# EAGLE design mcp3008_rpi_SOIP (EAGLE 7.2.0)
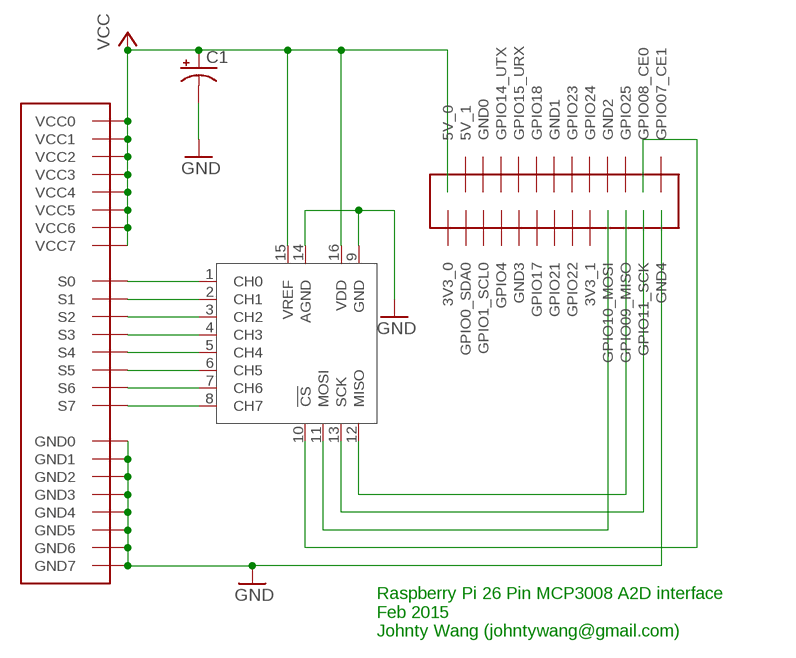
[diagram p0: schematic, sheet 1]

## Parts
C1  CPOL-USE2.5-6  [E2,5-6]
U$1  3BY83X8_SAMTEC  [3X8_PKG]
U$2  RPI_26  [RPI26]
U$3  MCP3008SL  [SO16]

## Nets
GND: C1.- U$1.GND0 U$1.GND1 U$1.GND2 U$1.GND3 U$1.GND4 U$1.GND5 U$1.GND6 U$1.GND7 U$2.GND4 U$3.9(GND) U$3.14(AGND)
N$1: U$1.S0 U$3.1(CH0)
N$2: U$1.S1 U$3.2(CH1)
N$3: U$1.S2 U$3.3(CH2)
N$4: U$1.S3 U$3.4(CH3)
N$5: U$1.S4 U$3.5(CH4)
N$6: U$1.S5 U$3.6(CH5)
N$7: U$1.S6 U$3.7(CH6)
N$8: U$1.S7 U$3.8(CH7)
N$9: U$2.GPIO09(GPIO09_MISO) U$3.12(MISO)
N$10: U$2.GPIO11(GPIO11_SCK) U$3.13(SCK)
N$11: U$2.GPIO10(GPIO10_MOSI) U$3.11(MOSI)
N$12: U$2.GPIO08(GPIO08_CE0) U$3.10(!CS)
VCC: C1.+ U$1.VCC0 U$1.VCC1 U$1.VCC2 U$1.VCC3 U$1.VCC4 U$1.VCC5 U$1.VCC6 U$1.VCC7 U$2.5V0(5V_0) U$3.15(VREF) U$3.16(VDD)
Unconnected: U$2.3V3_0 U$2.3V3_1 U$2.5V1(5V_1) U$2.GND0 U$2.GND1 U$2.GND2 U$2.GND3 U$2.GPIO0(GPIO0_SDA0) U$2.GPIO01(GPIO1_SCL0) U$2.GPIO04(GPIO4) U$2.GPIO07(GPIO07_CE1) U$2.GPIO14(GPIO14_UTX) U$2.GPIO15(GPIO15_URX) U$2.GPIO17 U$2.GPIO18 U$2.GPIO21 U$2.GPIO22 U$2.GPIO23 U$2.GPIO24 U$2.GPIO25

## Notes on the sheet
- Raspberry Pi 26 Pin MCP3008 A2D interface
  Feb 2015
  Johnty Wang (johntywang@gmail.com)

## Library data of the parts
C1 = rcl:CPOL-US: POLARIZED CAPACITOR, American symbol
U$1 = jt_lib:3BY8: a 3 by 8 header
U$2 = jt_lib:RPI_26: RPi GPIO header (26 pin)
U$3 = MCP3008:MCP3008

## Net classes
0 default: width 0.254 mm

## Board
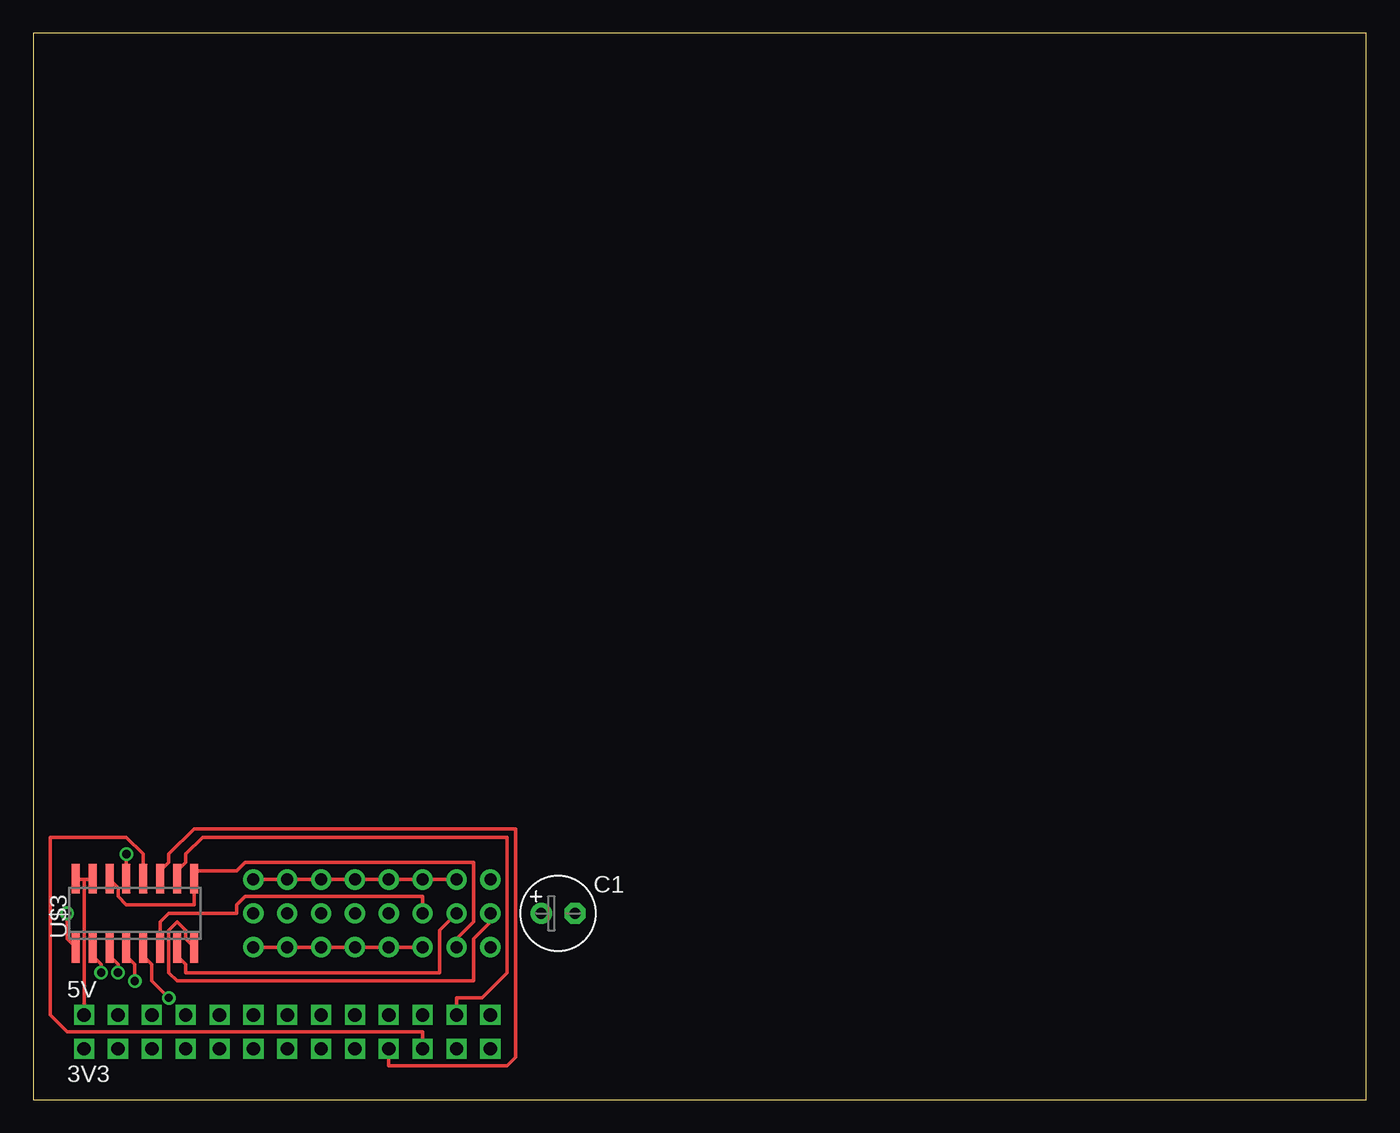
[diagram p1: board, top side]
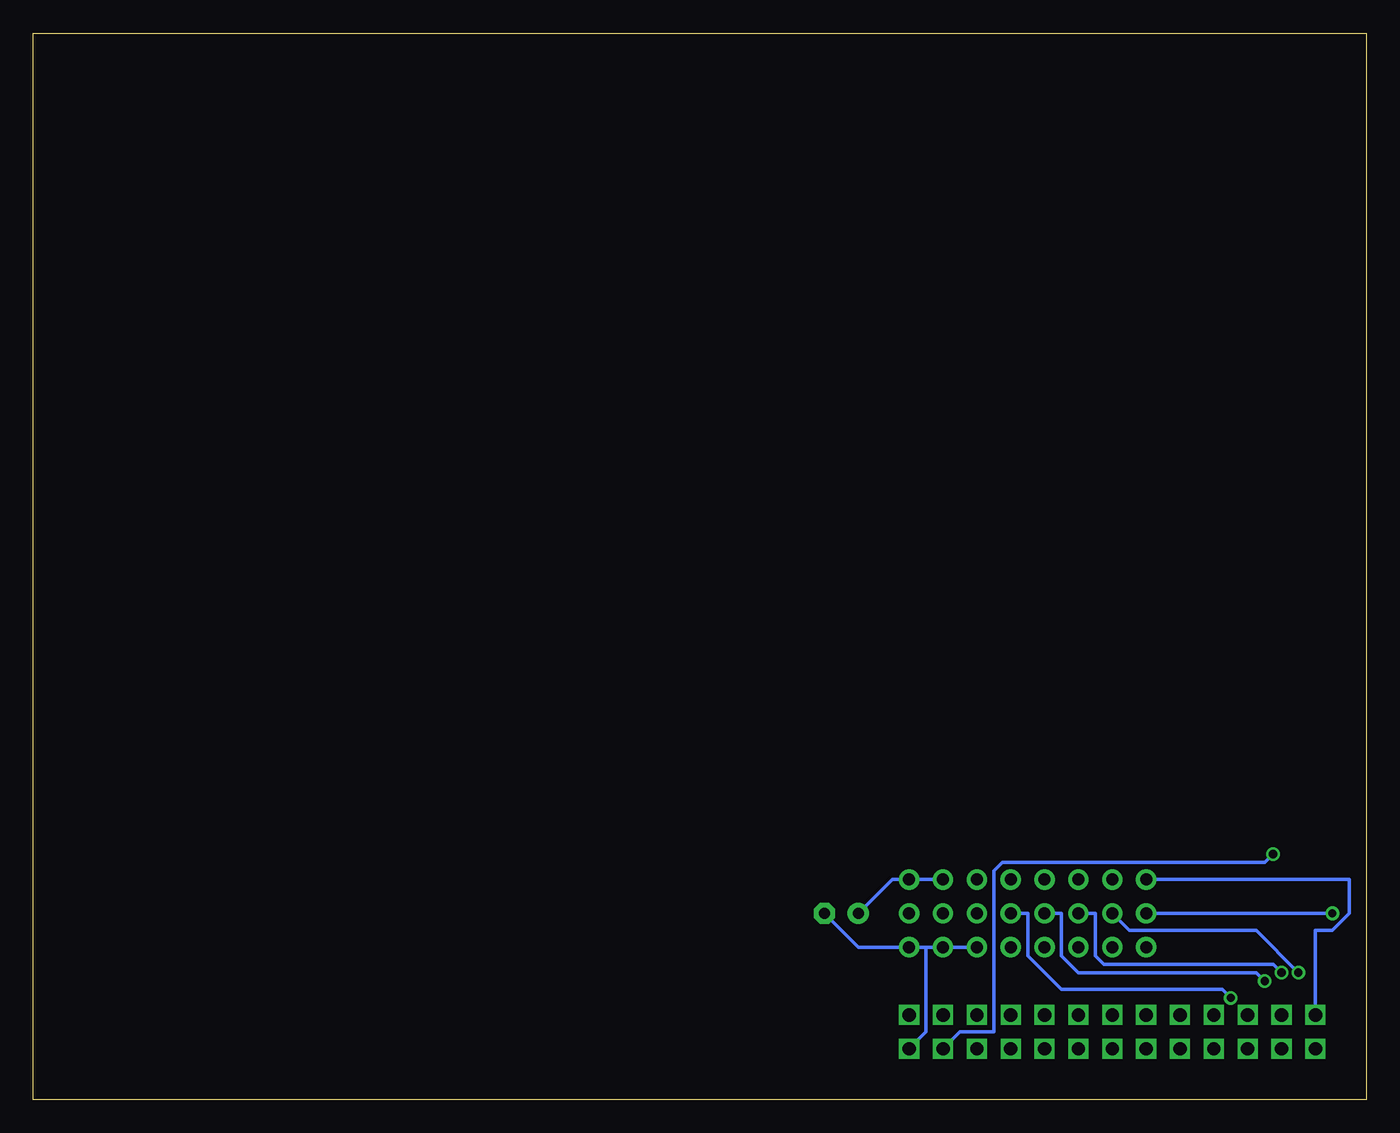
[diagram p2: board, bottom side, seen from below]

Size 100 x 80 mm. Coordinates in mm from the lower left corner, seen from the top.
Outline: 0,0 100,0 100,80 0,80 0,0
Copper layers (1*16): Top 0.035mm / dielectric 1.5mm / Bottom 0.035mm
Design rules "default": minimum track width 10mil, minimum drill 24mil, track to track 8mil, track to pad 8mil, pad to pad 8mil, via to via 8mil, smd to smd 8mil, copper to edge 40mil, drill to drill 8mil, minimum pad ring 10mil, minimum via ring 8mil, stop-mask expansion 4mil, vias tented up to drill 0mil, thermal gap 10mil

### Footprints (pad centres in the part's own frame; a part is rotated, then mirrored left to right if it is on the bottom)
E2,5-6 = drill 0.813 pad 1.6: + -1.27,0 | drill 0.813 pad 1.6 octagon: - 1.27,0
3X8_PKG = drill 0.9 pad 1.524: GND0 -5.08,-3.81; GND1 -2.54,-3.81; GND2 0,-3.81; GND3 2.54,-3.81; GND4 5.08,-3.81; GND5 7.62,-3.81; GND6 10.16,-3.81; GND7 12.7,-3.81; S0 -5.08,-1.27; S1 -2.54,-1.27; S2 0,-1.27; S3 2.54,-1.27; S4 5.08,-1.27; S5 7.62,-1.27; S6 10.16,-1.27; S7 12.7,-1.27; VCC0 -5.08,1.27; VCC1 -2.54,1.27; VCC2 0,1.27; VCC3 2.54,1.27; VCC4 5.08,1.27; VCC5 7.62,1.27; VCC6 10.16,1.27; VCC7 12.7,1.27
RPI26 = drill 1 square: 3V3_0 -13.97,-1.27; 3V3_1 6.35,-1.27; 5V0 -13.97,1.27; 5V1 -11.43,1.27; GND0 -8.89,1.27; GND1 1.27,1.27; GND2 8.89,1.27; GND3 -3.81,-1.27; GND4 16.51,-1.27; GPIO0 -11.43,-1.27; GPIO01 -8.89,-1.27; GPIO04 -6.35,-1.27; GPIO07 16.51,1.27; GPIO08 13.97,1.27; GPIO09 11.43,-1.27; GPIO10 8.89,-1.27; GPIO11 13.97,-1.27; GPIO14 -6.35,1.27; GPIO15 -3.81,1.27; GPIO17 -1.27,-1.27; GPIO18 -1.27,1.27; GPIO21 1.27,-1.27; GPIO22 3.81,-1.27; GPIO23 3.81,1.27; GPIO24 6.35,1.27; GPIO25 11.43,1.27
SO16 = smd 0.6 x 2.2: 1 -4.445,-2.6; 2 -3.175,-2.6; 3 -1.905,-2.6; 4 -0.635,-2.6; 5 0.635,-2.6; 6 1.905,-2.6; 7 3.175,-2.6; 8 4.445,-2.6; 9 4.445,2.6; 10 3.175,2.6; 11 1.905,2.6; 12 0.635,2.6; 13 -0.635,2.6; 14 -1.905,2.6; 15 -3.175,2.6; 16 -4.445,2.6

### Placement (x,y rotation side)
C1  39.37,13.97 0 top
U$1  21.59,15.24 0 top
U$2  17.78,5.08 0 top
U$3  7.62,13.97 0 top

### Tracks (layer width: path | path; a pad name or v marks a point on that pad's centre or on a via)
GND
  Top 0.254: U$1.GND0 U$1.GND1 U$1.GND2 U$1.GND3 U$1.GND4 U$1.GND5 | U$3.14 5.71,16.51 6.35,15.88 6.35,15.24 6.99,14.61 12.06,14.61 U$3.9 12.06,17.14 15.24,17.14 15.88,17.78 33.02,17.78 33.02,13.34 31.75,12.06 U$1.GND6
  Bottom 0.254: U$2.GND4 33.02,5.08 33.02,11.43 | 33.02,11.43 U$1.GND6 U$1.GND5 | 33.02,11.43 U$1.GND7 38.1,11.43 C1.-
N$1  (via drill 0.61)
  Top 0.254: v2.54,13.97 2.54,12.06 3.17,11.43 U$3.1
  Bottom 0.254: U$1.S0 v2.54,13.97
N$2  (via drill 0.61)
  Top 0.254: v5.08,9.53 5.08,10.16 4.45,10.79 U$3.2
  Bottom 0.254: v5.08,9.53 8.26,12.7 17.78,12.7 U$1.S1
N$3  (via drill 0.61)
  Top 0.254: v6.35,9.53 6.35,10.16 5.71,10.79 U$3.3
  Bottom 0.254: v6.35,9.53 6.99,10.16 19.68,10.16 20.32,10.79 20.32,13.97 U$1.S2
N$4  (via drill 0.61)
  Top 0.254: v7.62,8.89 7.62,10.16 6.99,10.79 U$3.4
  Bottom 0.254: v7.62,8.89 8.26,9.53 21.59,9.53 22.86,10.79 22.86,13.97 U$1.S3
N$5  (via drill 0.61)
  Top 0.254: v10.16,7.62 8.89,8.89 8.89,10.16 8.26,10.79 U$3.5
  Bottom 0.254: v10.16,7.62 10.79,8.26 22.86,8.26 25.4,10.79 25.4,13.97 U$1.S4
N$6
  Top 0.254: U$3.6 9.53,13.34 10.16,13.97 15.24,13.97 15.24,14.61 15.88,15.24 29.21,15.24 U$1.S5
N$7
  Top 0.254: U$1.S6 30.48,12.7 30.48,9.53 11.43,9.53 11.43,10.16 10.79,10.79 U$3.7
N$8
  Top 0.254: U$1.S7 34.29,13.34 33.02,12.06 33.02,8.89 10.79,8.89 10.16,9.53 10.16,12.7 10.79,13.34 11.43,12.7 11.43,12.06 12.06,11.43 U$3.8
N$9
  Top 0.254: U$3.12 8.26,18.41 6.99,19.68 1.27,19.68 1.27,6.35 2.54,5.08 29.21,5.08 U$2.GPIO09
N$10  (via drill 0.61)
  Top 0.254: v6.99,18.41 U$3.13
  Bottom 0.254: v6.99,18.41 7.62,17.78 27.3,17.78 27.94,17.14 27.94,5.08 30.48,5.08 U$2.GPIO11
N$11
  Top 0.254: U$2.GPIO10 26.67,2.54 35.56,2.54 36.2,3.17 36.2,20.32 12.06,20.32 10.16,18.41 10.16,17.78 9.53,17.14 U$3.11
N$12
  Top 0.254: U$2.GPIO08 31.75,7.62 33.66,7.62 35.56,9.53 35.56,19.68 12.7,19.68 11.43,18.41 11.43,17.78 10.79,17.14 U$3.10
VCC
  Top 0.254: 3.81,16.51 4.45,16.51 U$3.15 | 3.81,16.51 3.17,16.51 U$3.16 | U$2.5V0 3.81,16.51 | U$1.VCC0 U$1.VCC1 U$1.VCC2 U$1.VCC3 U$1.VCC4 U$1.VCC5 U$1.VCC6
  Bottom 0.254: U$1.VCC6 U$1.VCC7 35.56,16.51 C1.+ | U$2.5V0 3.81,12.7 2.54,12.7 1.27,13.97 1.27,16.51 U$1.VCC0